# EAGLE schematic FY (EAGLE 9.6.2)

## Sheet 1 of 7
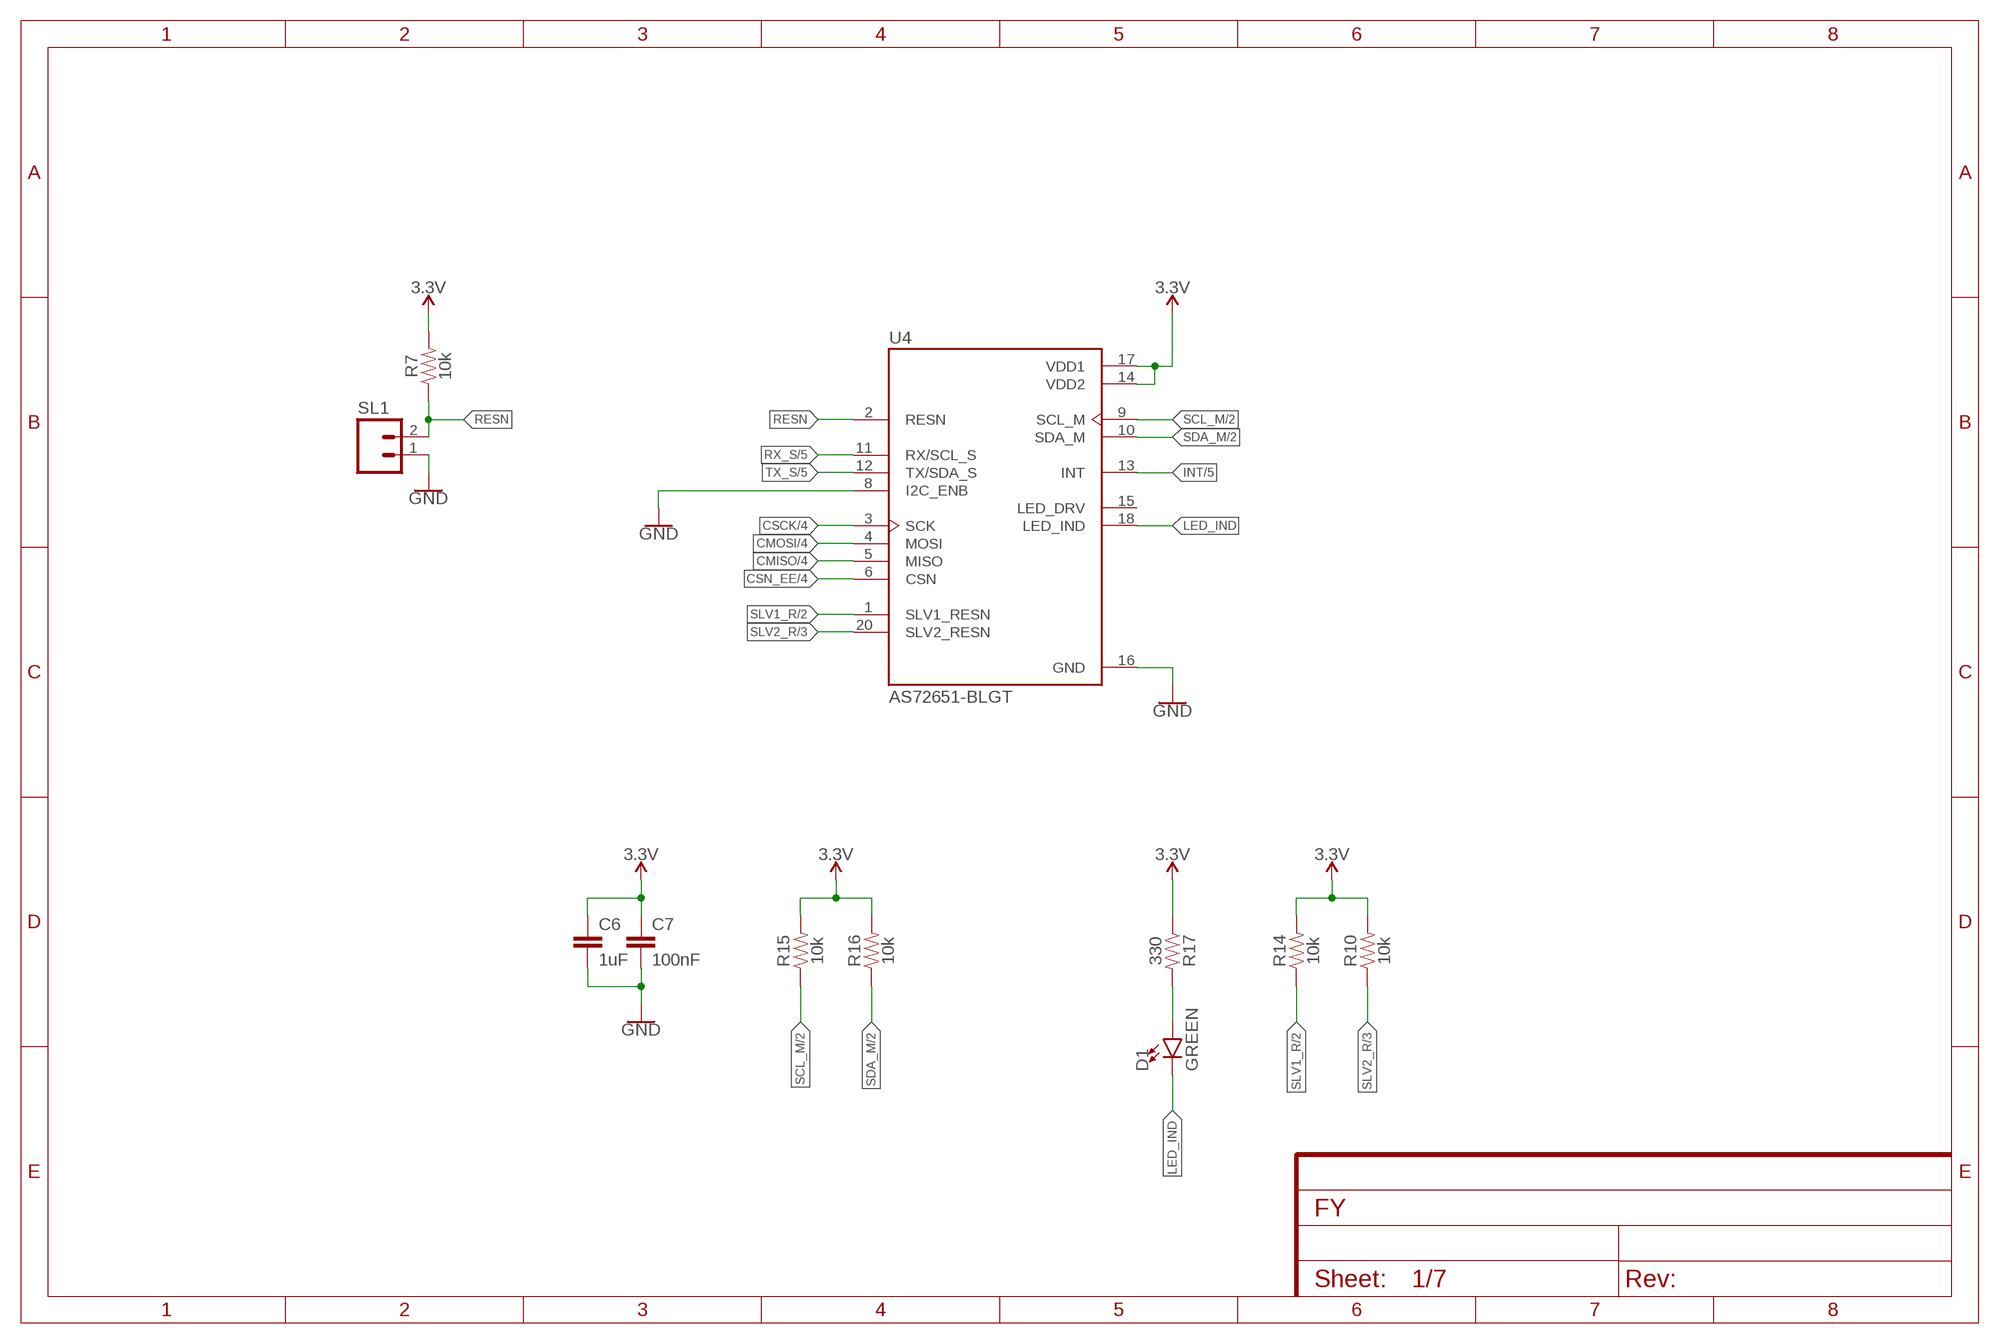
[diagram p0: schematic, sheet 1]

### Parts
C6  1uF  10UF-0603-6.3V-20%  [0603]
C7  100nF  0.1UF-0603-25V-(+80/-20%)  [0603]
D1  GREEN  LED-GREEN0603  [LED-0603]
R7  10k  10KOHM-0603-1/10W-1%  [0603]
R10  10k  10KOHM-0603-1/10W-1%  [0603]
R14  10k  10KOHM-0603-1/10W-1%  [0603]
R15  10k  10KOHM-0603-1/10W-1%  [0603]
R16  10k  10KOHM-0603-1/10W-1%  [0603]
R17  330  10KOHM-0603-1/10W-1%  [0603]
SL1  M02  [02P]
U4  AS72651-BLGT  [PQFN65P470X450X270-20N]

### Nets
3.3V [Power]: C6.1 C7.1 R7.2 R10.2 R14.2 R15.2 R16.2 R17.1 U4.14(VDD2) U4.17(VDD1) ; also sheet 2,3,4,5,6,7
CMISO: U4.5(MISO) ; also sheet 4
CMOSI: U4.4(MOSI) ; also sheet 4
CSCK: U4.3(SCK) ; also sheet 4
CSN_EE: U4.6(CSN) ; also sheet 4
GND: C6.2 C7.2 SL1.1 U4.8(I2C_ENB) U4.16(GND) ; also sheet 2,3,4,5,6,7
INT: U4.13(INT) ; also sheet 5
LED_IND: D1.C U4.18(LED_IND)
N$14: D1.A R17.2
RESN: R7.1 SL1.2 U4.2(RESN)
RX_S: U4.11(RX/SCL_S) ; also sheet 5
SCL_M: R15.1 U4.9(SCL_M) ; also sheet 2,3
SDA_M: R16.1 U4.10(SDA_M) ; also sheet 2,3
SLV1_R: R14.1 U4.1(SLV1_RESN) ; also sheet 2
SLV2_R: R10.1 U4.20(SLV2_RESN) ; also sheet 3
TX_S: U4.12(TX/SDA_S) ; also sheet 5
Unconnected: U4.15(LED_DRV)

## Sheet 2 of 7
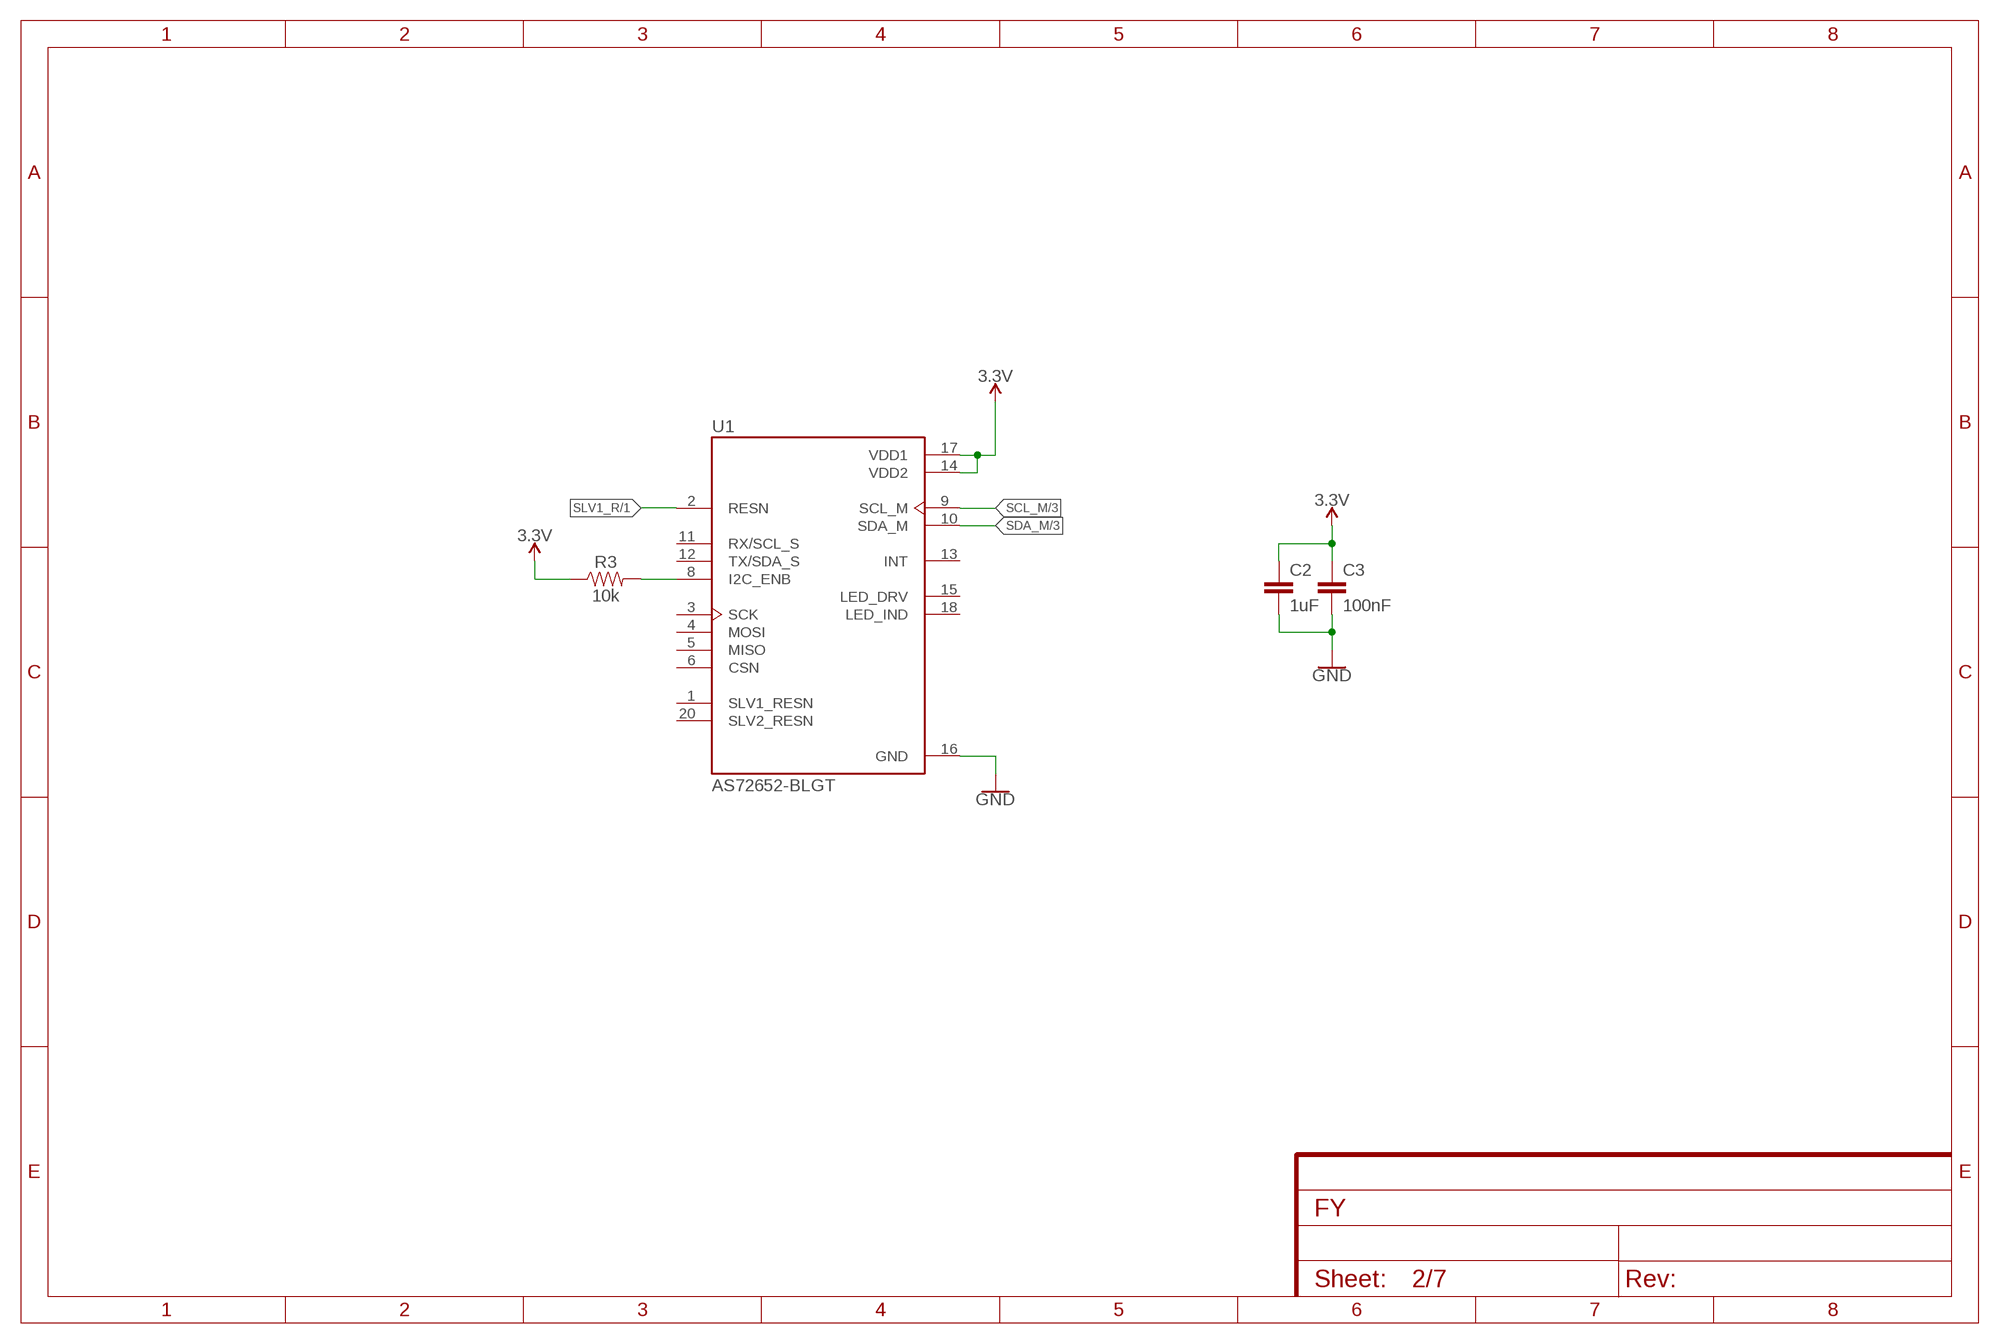
[diagram p1: schematic, sheet 2]

### Parts
C2  1uF  10UF-0603-6.3V-20%  [0603]
C3  100nF  0.1UF-0603-25V-(+80/-20%)  [0603]
R3  10k  0.05OHM-0603-1/5W-1%  [0603]
U1  AS72652-BLGT  AS72651-BLGT  [PQFN65P470X450X270-20N]

### Nets
3.3V [Power]: C2.1 C3.1 R3.1 U1.14(VDD2) U1.17(VDD1) ; also sheet 1,3,4,5,6,7
GND: C2.2 C3.2 U1.16(GND) ; also sheet 1,3,4,5,6,7
N$1: R3.2 U1.8(I2C_ENB)
SCL_M: U1.9(SCL_M) ; also sheet 1,3
SDA_M: U1.10(SDA_M) ; also sheet 1,3
SLV1_R: U1.2(RESN) ; also sheet 1
Unconnected: U1.1(SLV1_RESN) U1.3(SCK) U1.4(MOSI) U1.5(MISO) U1.6(CSN) U1.11(RX/SCL_S) U1.12(TX/SDA_S) U1.13(INT) U1.15(LED_DRV) U1.18(LED_IND) U1.20(SLV2_RESN)

## Sheet 3 of 7
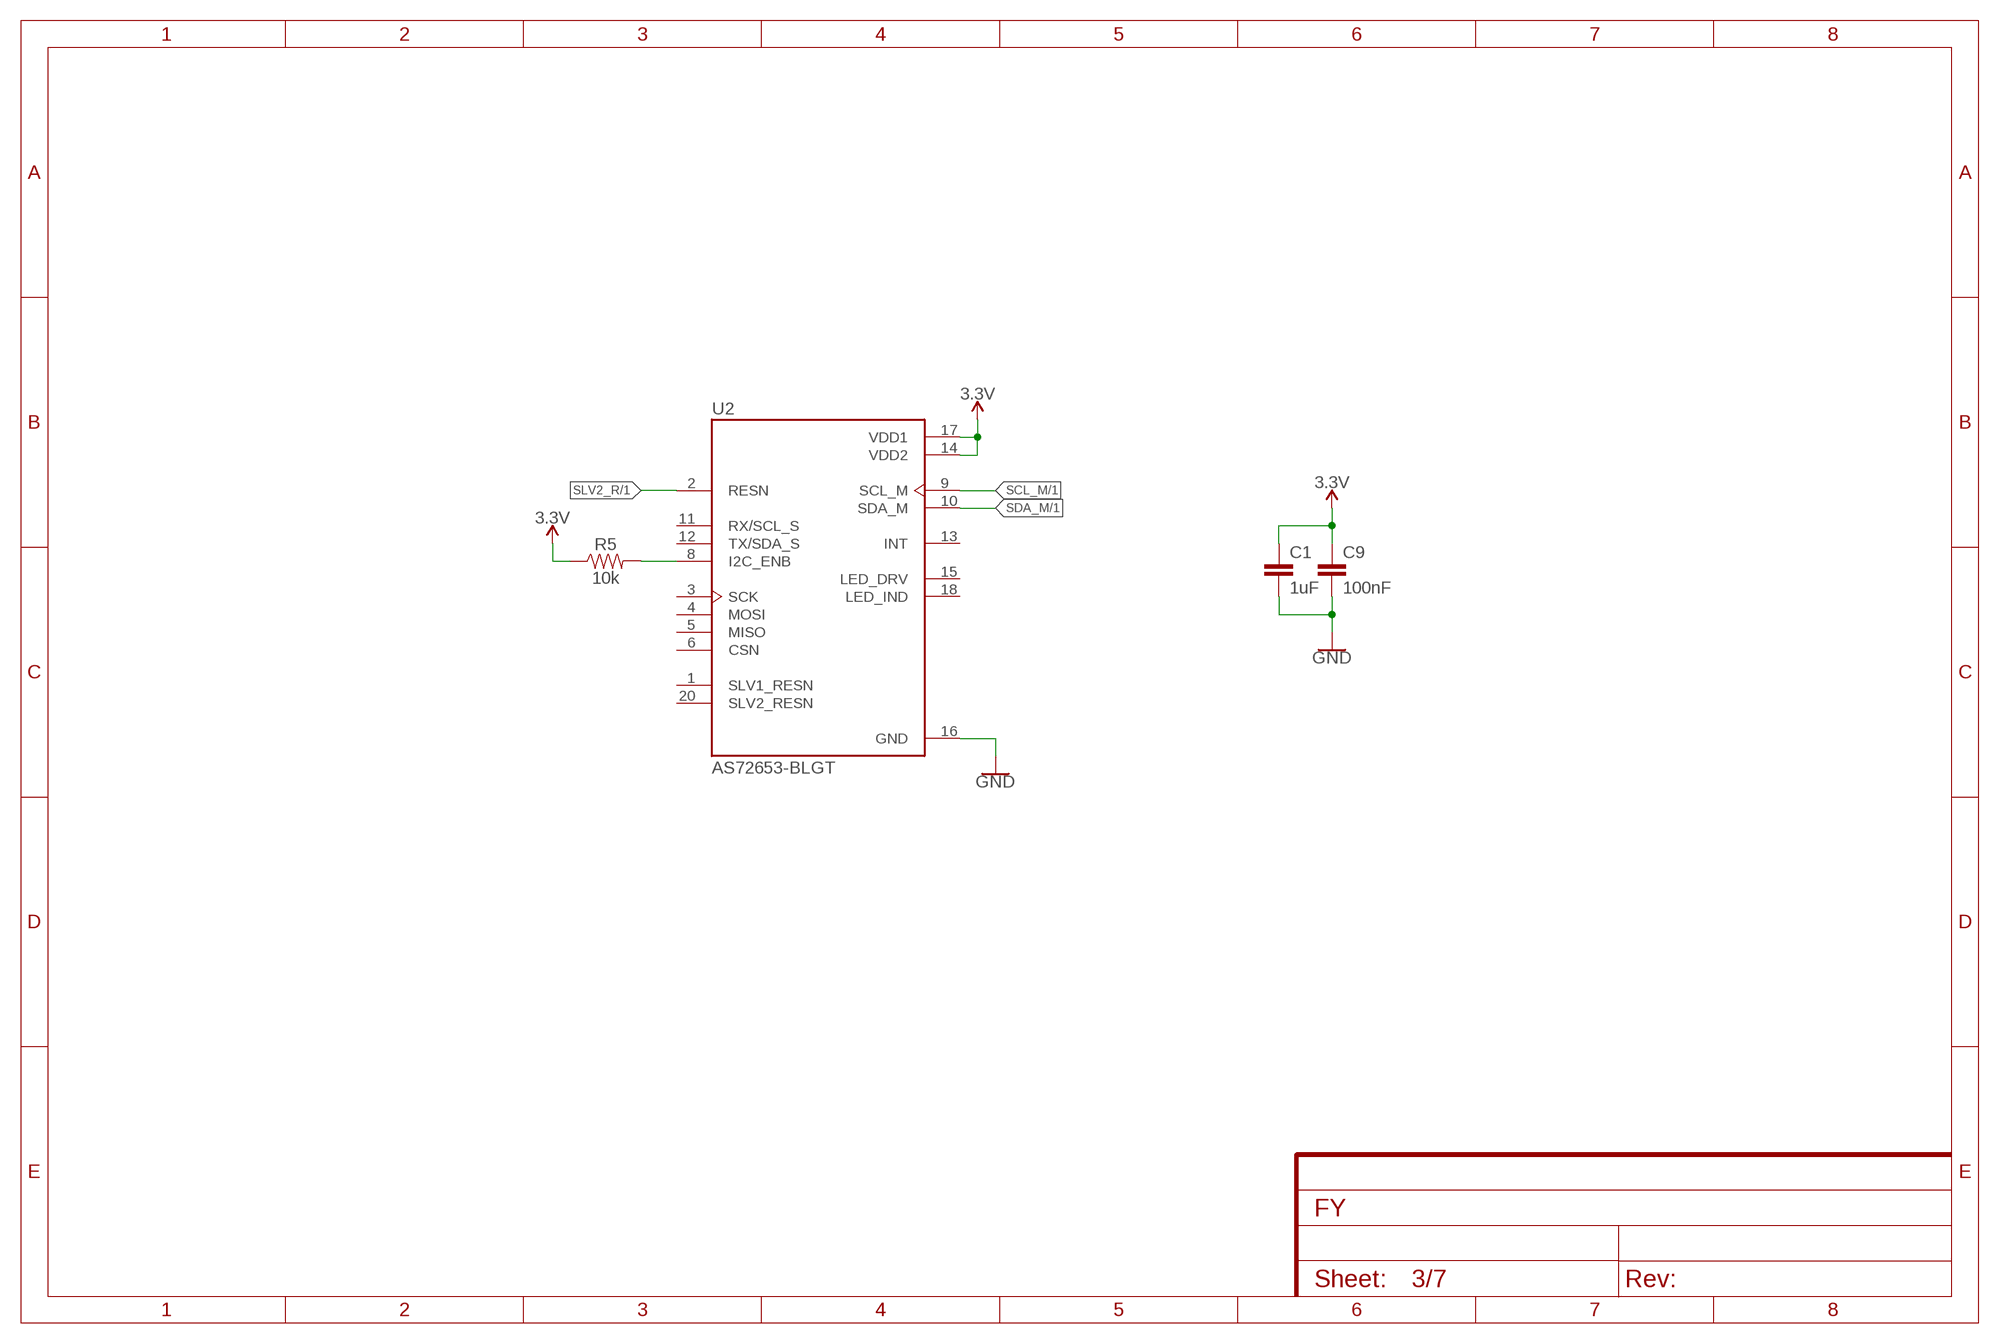
[diagram p2: schematic, sheet 3]

### Parts
C1  1uF  10UF-0603-6.3V-20%  [0603]
C9  100nF  0.1UF-0603-25V-(+80/-20%)  [0603]
R5  10k  0.05OHM-0603-1/5W-1%  [0603]
U2  AS72653-BLGT  AS72651-BLGT  [PQFN65P470X450X270-20N]

### Nets
3.3V [Power]: C1.1 C9.1 R5.1 U2.14(VDD2) U2.17(VDD1) ; also sheet 1,2,4,5,6,7
GND: C1.2 C9.2 U2.16(GND) ; also sheet 1,2,4,5,6,7
N$5: R5.2 U2.8(I2C_ENB)
SCL_M: U2.9(SCL_M) ; also sheet 1,2
SDA_M: U2.10(SDA_M) ; also sheet 1,2
SLV2_R: U2.2(RESN) ; also sheet 1
Unconnected: U2.1(SLV1_RESN) U2.3(SCK) U2.4(MOSI) U2.5(MISO) U2.6(CSN) U2.11(RX/SCL_S) U2.12(TX/SDA_S) U2.13(INT) U2.15(LED_DRV) U2.18(LED_IND) U2.20(SLV2_RESN)

## Sheet 4 of 7
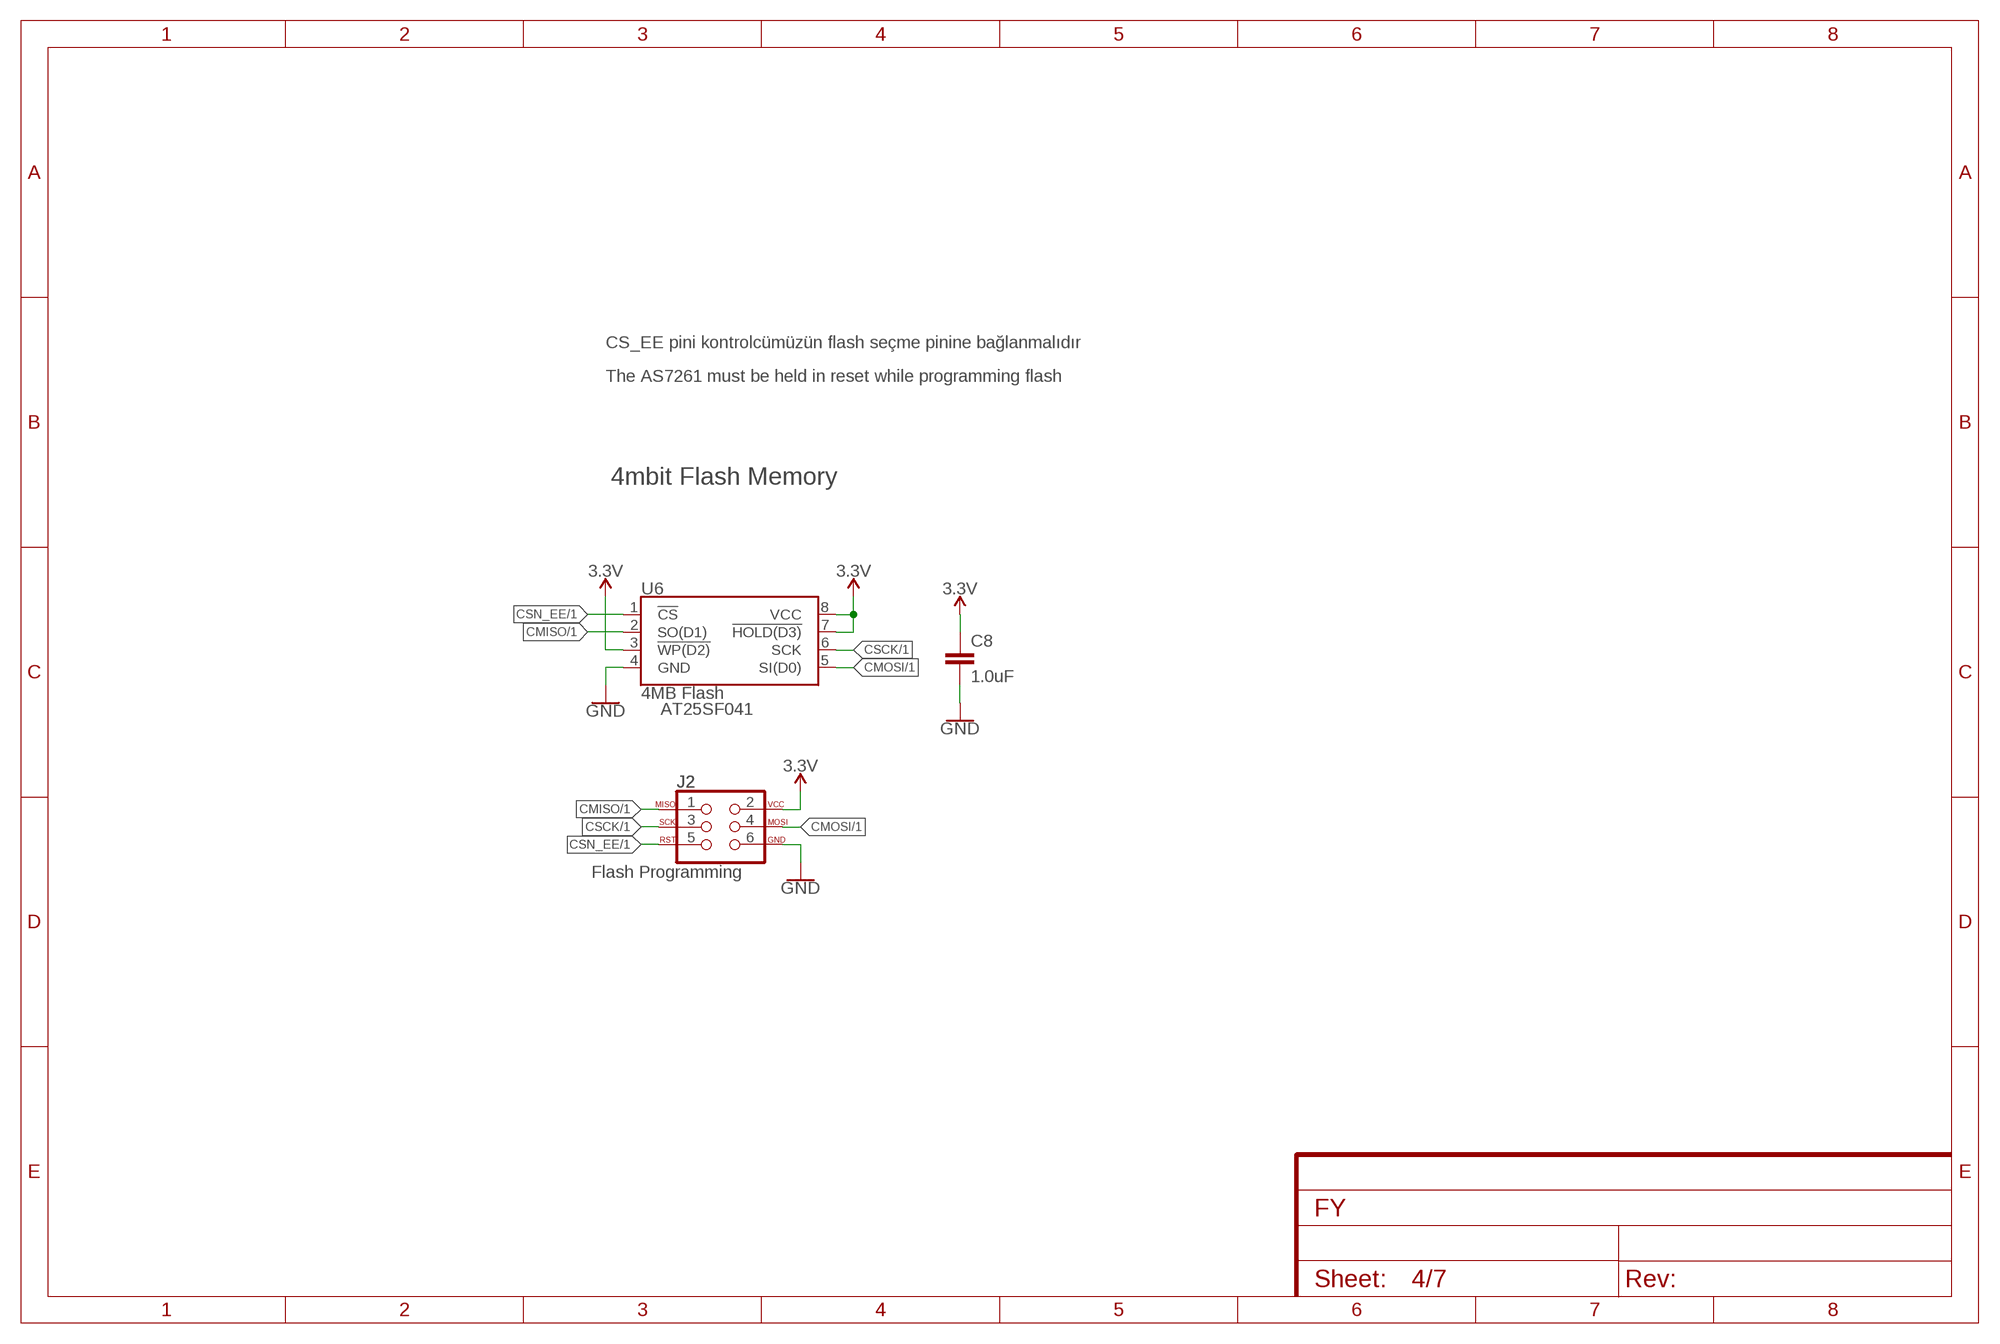
[diagram p3: schematic, sheet 4]

### Parts
C8  1.0uF  1.0UF-0603-16V-10%  [0603]
J2  Flash Programming  AVR_SPI_PROG_3X2TESTPOINTS  [2X3_TEST_POINTS]
U6  4MB Flash  AT25SF041  [SO08]

### Nets
3.3V [Power]: C8.1 J2.2 U6.3(!WP(D2)) U6.7(!HOLD(D3)) U6.8(VCC) ; also sheet 1,2,3,5,6,7
CMISO: J2.1 U6.2(SO(D1)) ; also sheet 1
CMOSI: J2.4 U6.5(SI(D0)) ; also sheet 1
CSCK: J2.3 U6.6(SCK) ; also sheet 1
CSN_EE: J2.5 U6.1(!CS) ; also sheet 1
GND: C8.2 J2.6 U6.4(GND) ; also sheet 1,2,3,5,6,7

### Notes on the sheet
- CS_EE pini kontrolcümüzün flash seçme pinine bağlanmalıdır
- The AS7261 must be held in reset while programming flash
- 4mbit Flash Memory
- AT25SF041

## Sheet 5 of 7
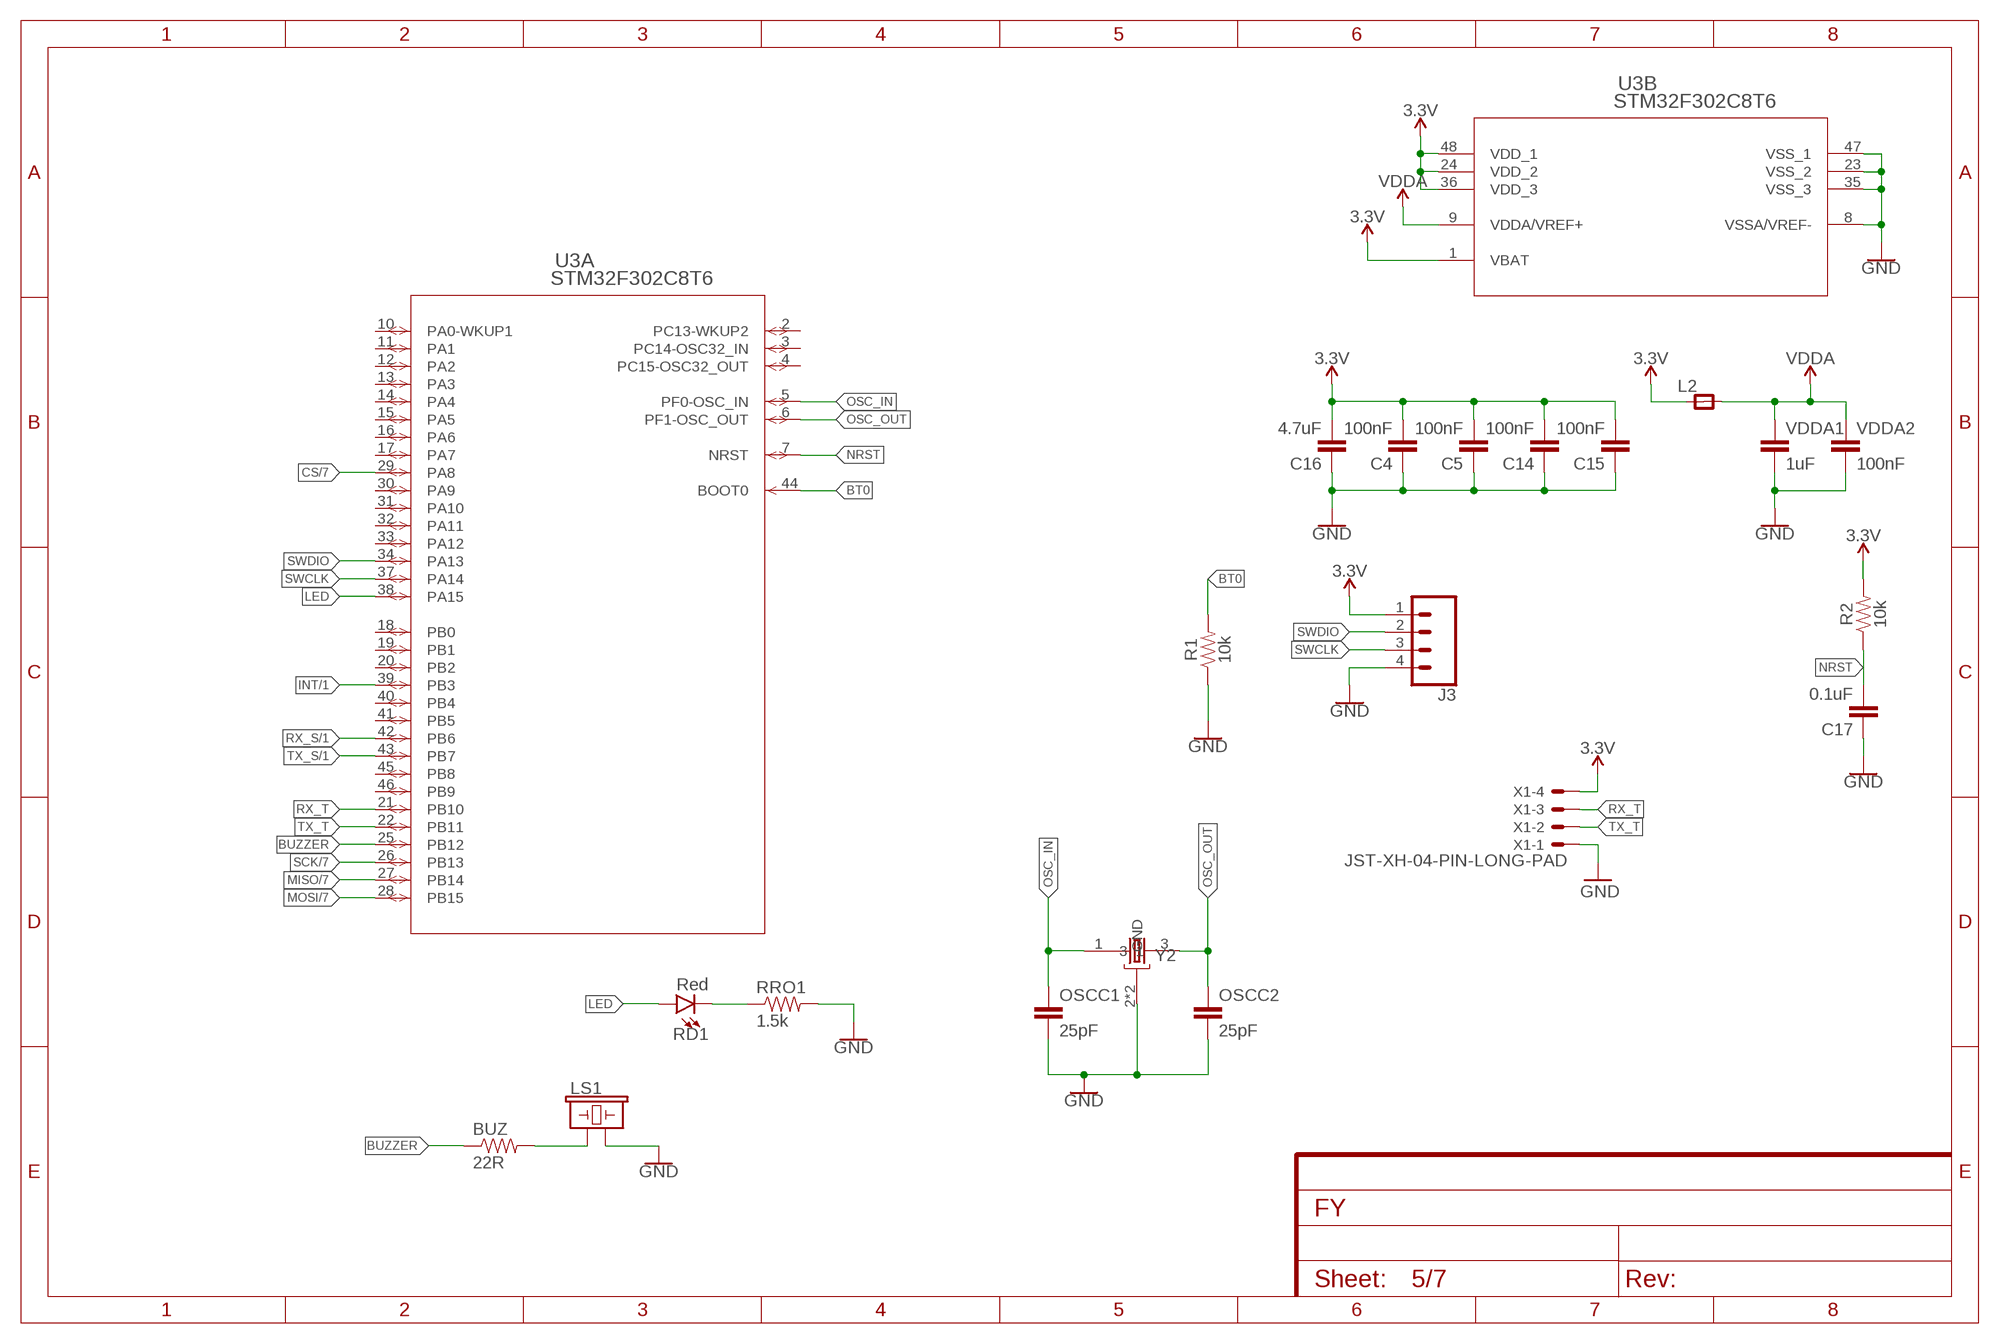
[diagram p4: schematic, sheet 5]

### Parts
BUZ  22R  2.0KOHM1/10W5%(0603)  [0603-RES]
C4  100nF  22PF-0603-50V-5%  [0603]
C5  100nF  22PF-0603-50V-5%  [0603]
C14  100nF  22PF-0603-50V-5%  [0603]
C15  100nF  22PF-0603-50V-5%  [0603]
C16  4.7uF  22PF-0603-50V-5%  [0603]
C17  0.1uF  22PF-0603-50V-5%  [0603]
J3  CONN_04  [1X04]
L2  RC-MASTER-SMD_FB_0805MP  [RC-MASTER-SMD_L0805MP]
LS1  BUZZER-PTH  [BUZZER-12MM]
OSCC1  25pF  0.1UF-0603-25V-(+80/-20%)  [0603]
OSCC2  25pF  0.1UF-0603-25V-(+80/-20%)  [0603]
R1  10k  0.05OHM-0603-1/5W-1%  [0603]
R2  10k  0.05OHM-0603-1/5W-1%  [0603]
RD1  Red  LED-RED0603-SMART  [LED-0603]
RRO1  1.5k  2.0KOHM1/10W5%(0603)  [0603-RES]
U3  STM32F302C8T6  [LQFP48-7X7MM]
VDDA1  1uF  0.1UF-0603-25V-(+80/-20%)  [0603]
VDDA2  100nF  0.1UF-0603-25V-(+80/-20%)  [0603]
X1  JST-XH-04-PIN-LONG-PAD  [JST-XH-04-PACKAGE-LONG-PAD]
Y2  ABM2B-8.000MHZ-10-1-U-T  ABM3B-26.000MHZ-10-1-U-T  [OSCCC500X320X110-4N]

### Nets
3.3V [Power]: C4.2 C5.2 C14.2 C15.2 C16.2 J3.1 L2.1 R2.2 U3.1(B:VBAT) U3.24(B:VDD_2) U3.36(B:VDD_3) U3.48(B:VDD_1) X1.4 ; also sheet 1,2,3,4,6,7
BT0: R1.2 U3.44(A:BOOT0)
BUZZER: BUZ.1 U3.25(A:PB12)
CS: U3.29(A:PA8) ; also sheet 7
GND: C4.1 C5.1 C14.1 C15.1 C16.1 C17.1 J3.4 LS1.- OSCC1.2 OSCC2.2 R1.1 RRO1.2 U3.8(B:VSSA/VREF-) U3.23(B:VSS_2) U3.35(B:VSS_3) U3.47(B:VSS_1) VDDA1.2 VDDA2.2 X1.1 Y2.2(GND) Y2.4(GND) ; also sheet 1,2,3,4,6,7
INT: U3.39(A:PB3) ; also sheet 1
LED: RD1.A U3.38(A:PA15)
MISO: U3.27(A:PB14) ; also sheet 7
MOSI: U3.28(A:PB15) ; also sheet 7
N$2: RD1.C RRO1.1
N$13: BUZ.2 LS1.+
NRST: C17.2 R2.1 U3.7(A:NRST)
OSC_IN: OSCC1.1 U3.5(A:PF0-OSC_IN) Y2.1
OSC_OUT: OSCC2.1 U3.6(A:PF1-OSC_OUT) Y2.3
RX_S: U3.42(A:PB6) ; also sheet 1
RX_T: U3.21(A:PB10) X1.3
SCK: U3.26(A:PB13) ; also sheet 7
SWCLK: J3.3 U3.37(A:PA14)
SWDIO: J3.2 U3.34(A:PA13)
TX_S: U3.43(A:PB7) ; also sheet 1
TX_T: U3.22(A:PB11) X1.2
VDDA: L2.2 U3.9(B:VDDA/VREF+) VDDA1.1 VDDA2.1
Unconnected: U3.2(A:PC13-WKUP2) U3.3(A:PC14-OSC32_IN) U3.4(A:PC15-OSC32_OUT) U3.10(A:PA0-WKUP1) U3.11(A:PA1) U3.12(A:PA2) U3.13(A:PA3) U3.14(A:PA4) U3.15(A:PA5) U3.16(A:PA6) U3.17(A:PA7) U3.18(A:PB0) U3.19(A:PB1) U3.20(A:PB2) U3.30(A:PA9) U3.31(A:PA10) U3.32(A:PA11) U3.33(A:PA12) U3.40(A:PB4) U3.41(A:PB5) U3.45(A:PB8) U3.46(A:PB9)

## Sheet 6 of 7
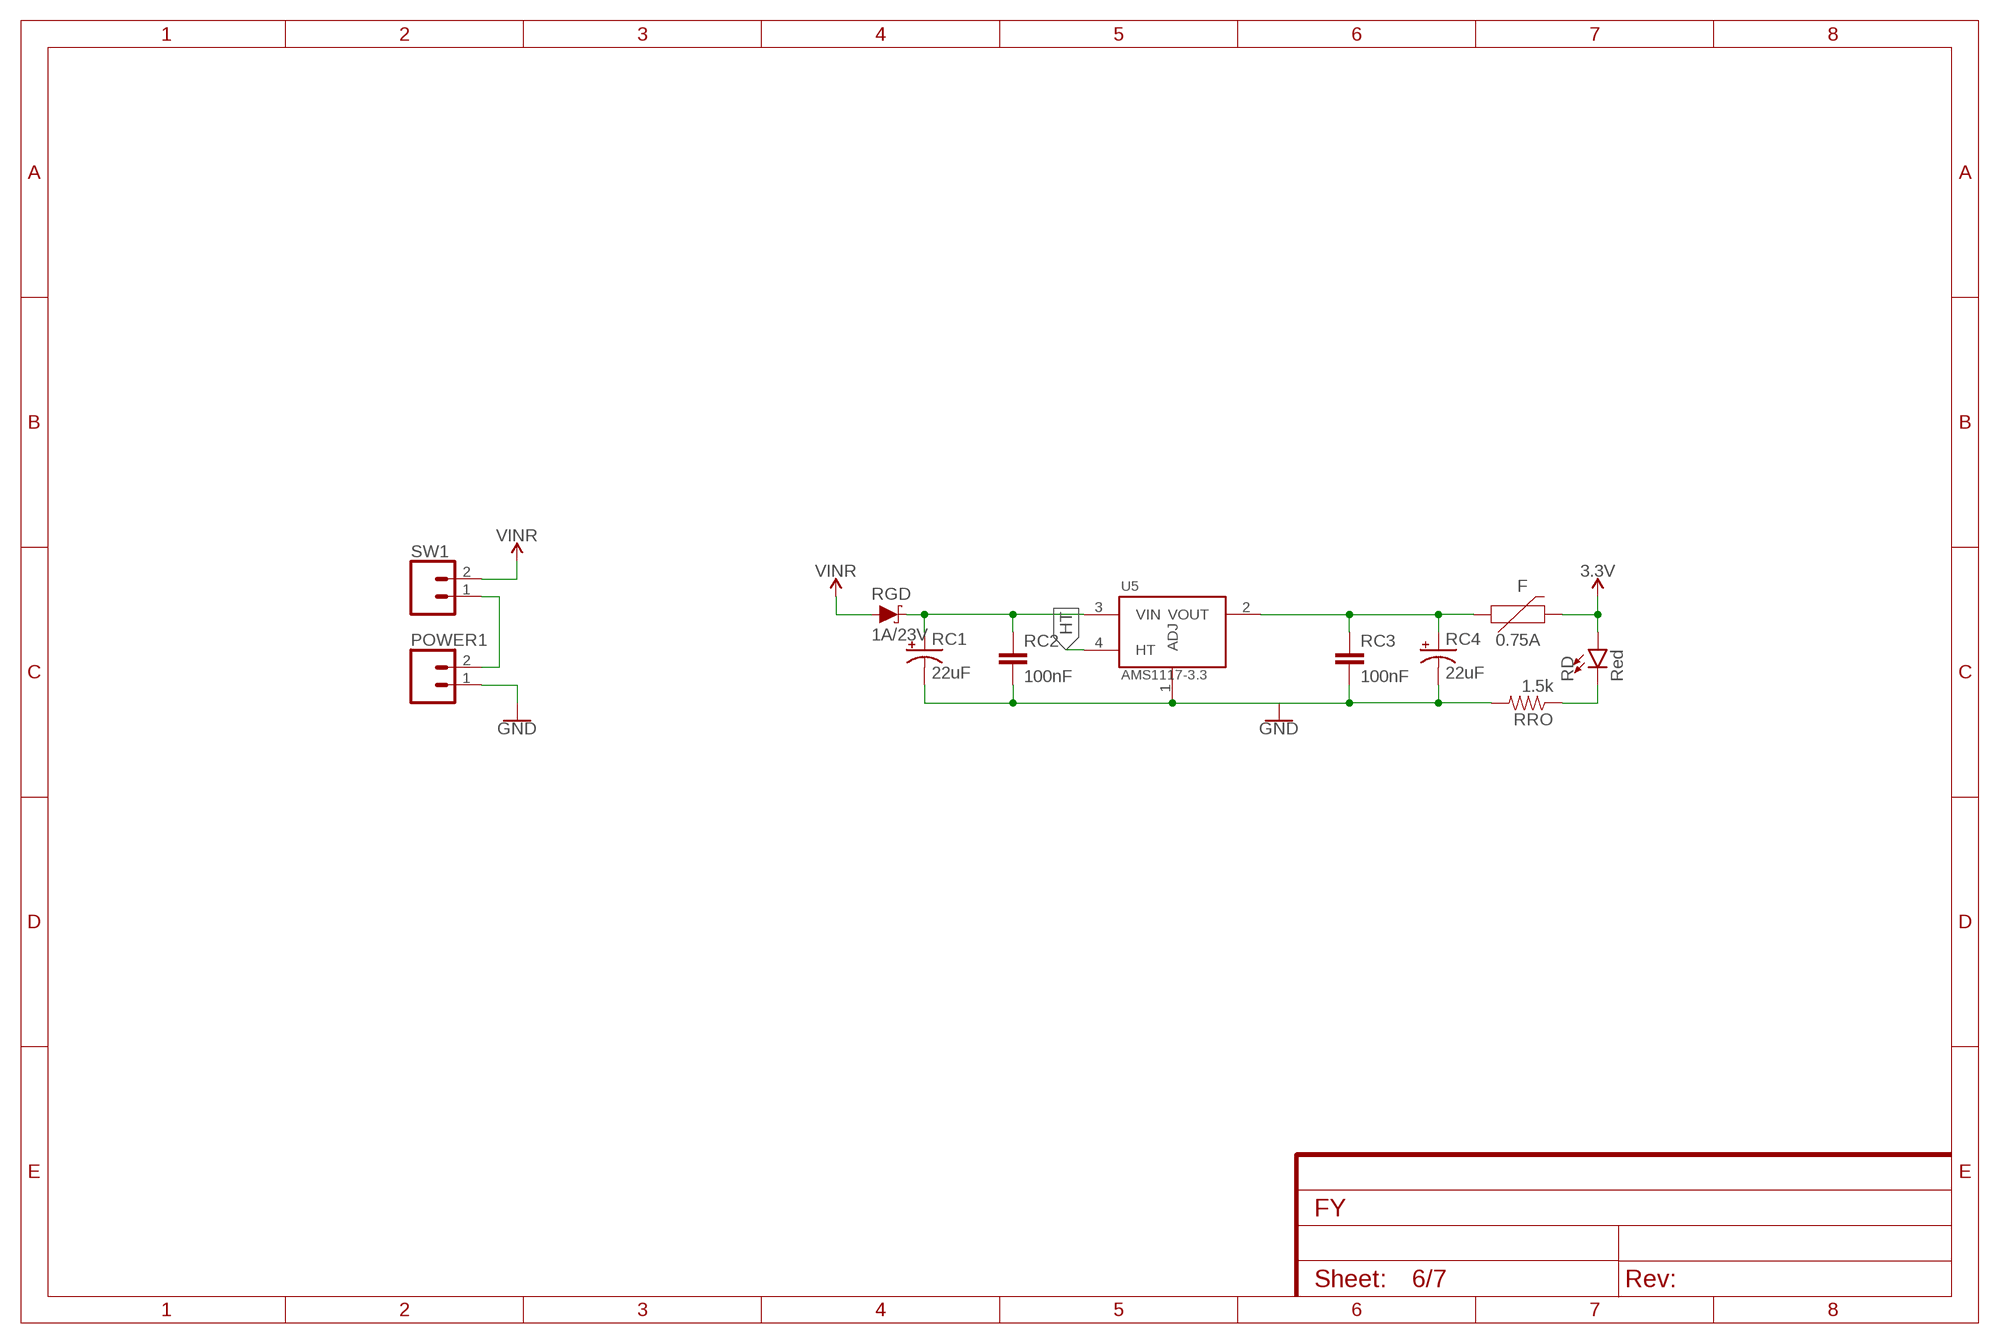
[diagram p5: schematic, sheet 6]

### Parts
F  0.75A  PPTC_THREE-QUARTER-AMP  [1206]
POWER1  CONN_023.5MM-NO_SILK  [SCREWTERMINAL-3.5MM-2-NS]
RC1  22uF  10UF-POLAR-EIA3528-20V-10%(TANT)  [EIA3528]
RC2  100nF  0.1UF-0603-25V-(+80/-20%)  [0603]
RC3  100nF  0.1UF-0603-25V-(+80/-20%)  [0603]
RC4  22uF  10UF-POLAR-EIA3528-20V-10%(TANT)  [EIA3528]
RD  Red  LED-RED0603-SMART  [LED-0603]
RGD  1A/23V  DIODE-SCHOTTKY-BAT20J  [SOD-323]
RRO  1.5k  2.0KOHM1/10W5%(0603)  [0603-RES]
SW1  CONN_023.5MM-NO_SILK  [SCREWTERMINAL-3.5MM-2-NS]
U5  AMS1117-3.3  [SOT229P700X180-4N]

### Nets
3.3V [Power]: F.2 RD.A ; also sheet 1,2,3,4,5,7
GND: POWER1.1 RC1.C(-) RC2.2 RC3.2 RC4.C(-) RRO.2 U5.1(ADJ) ; also sheet 1,2,3,4,5,7
HT: U5.4(HT)
N$3: POWER1.2 SW1.1
N$6: F.1 RC3.1 RC4.A(+) U5.2(VOUT)
N$11: RD.C RRO.1
VIN: RGD.A SW1.2 ; supply symbol labelled VINR
VNR: RC1.A(+) RC2.1 RGD.C U5.3(VIN)

## Sheet 7 of 7
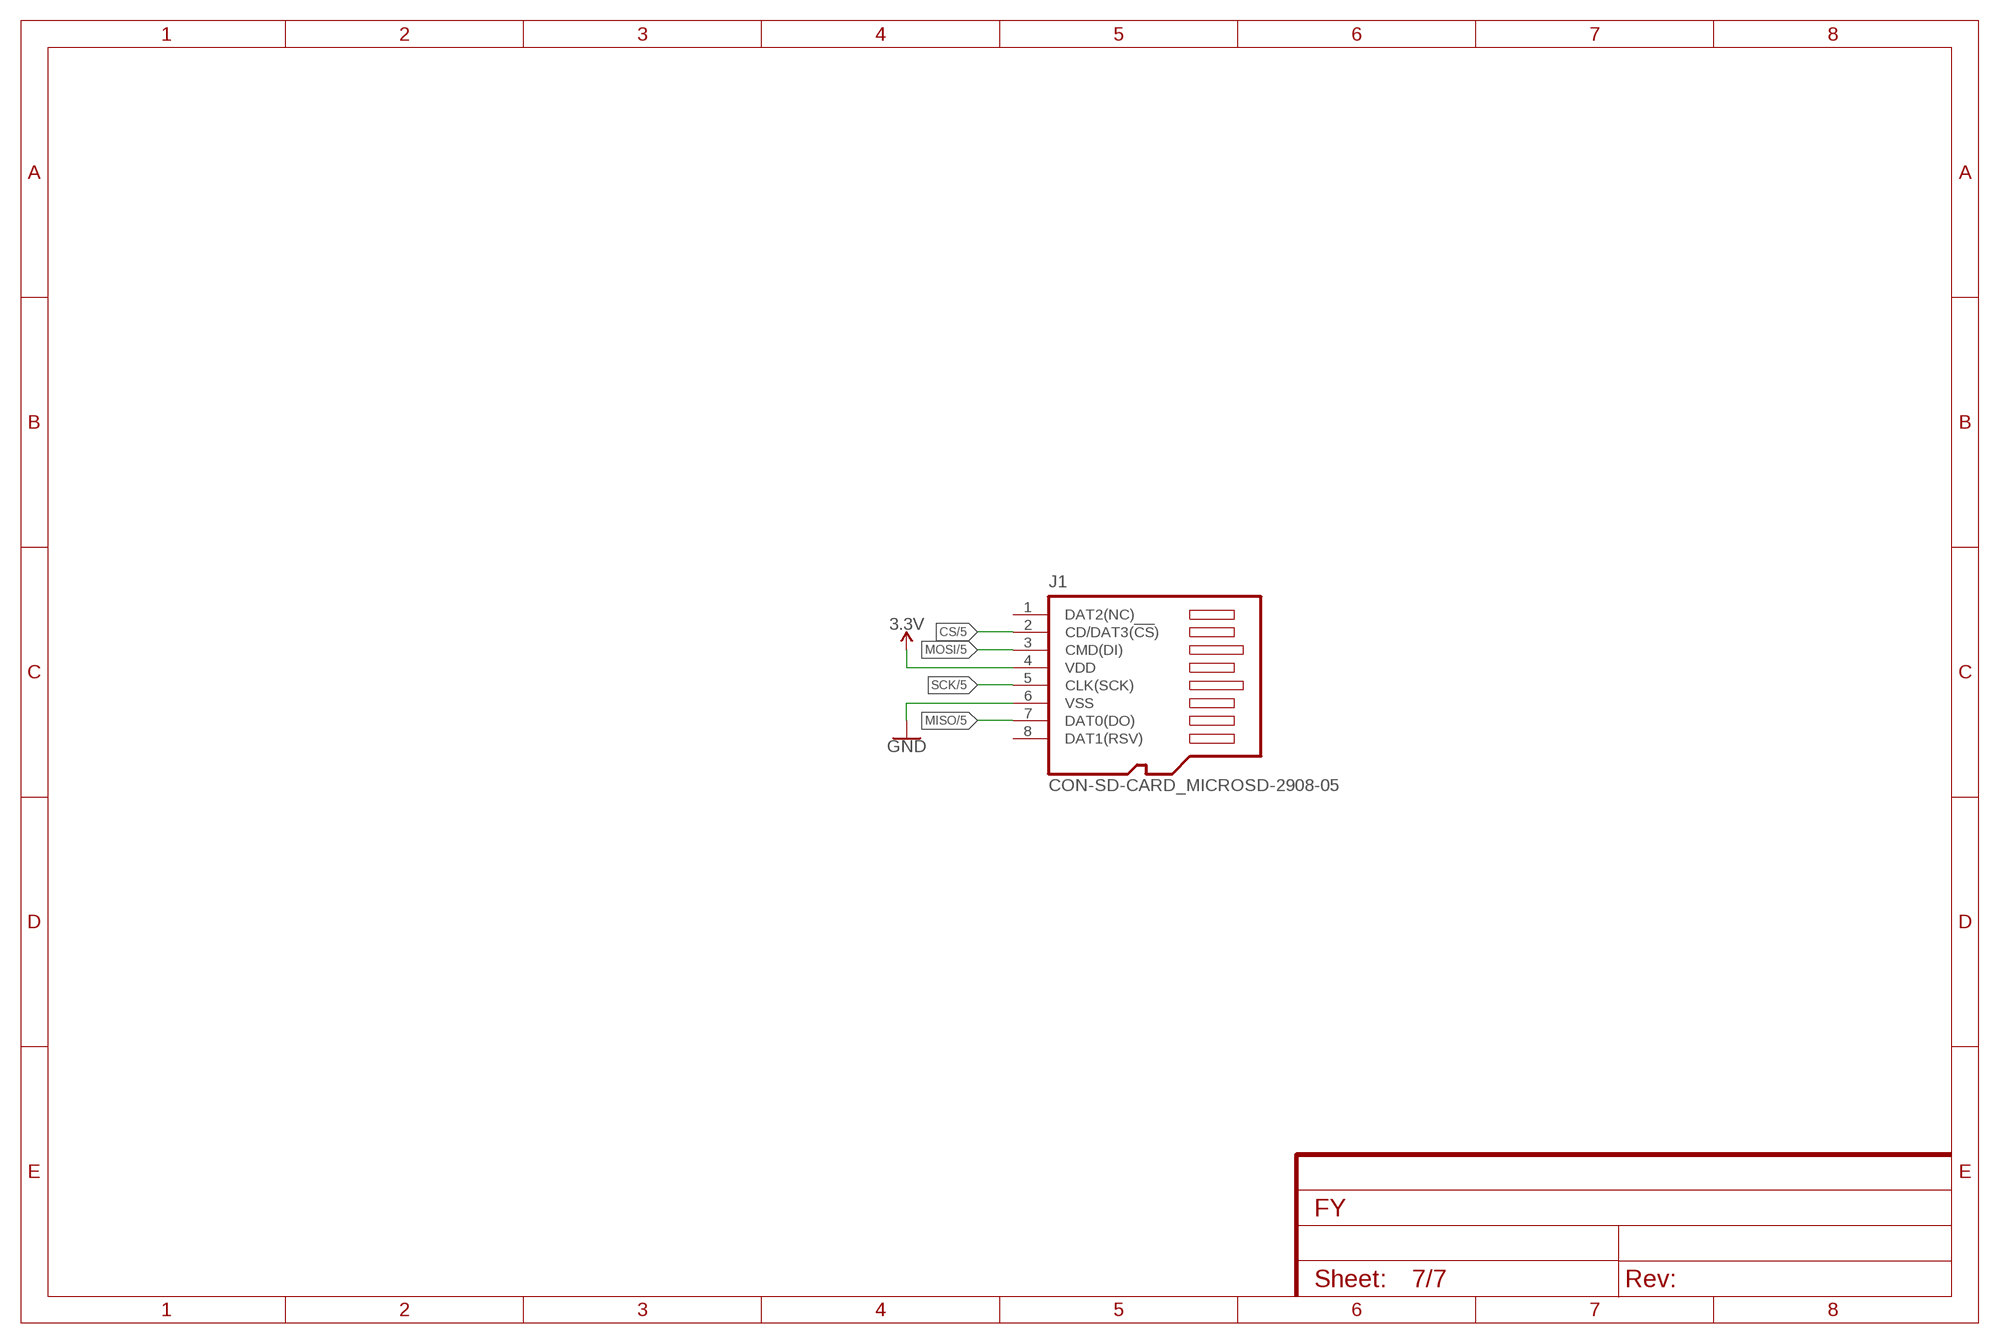
[diagram p6: schematic, sheet 7]

### Parts
J1  CON-SD-CARD_MICROSD-2908-05  [CON-SD-CARD_2908-05]

### Nets
3.3V [Power]: J1.4(VDD) ; also sheet 1,2,3,4,5,6
CS: J1.2(CD/DAT3(!CS!)) ; also sheet 5
GND: J1.6(VSS) ; also sheet 1,2,3,4,5,6
MISO: J1.7(DAT0(DO)) ; also sheet 5
MOSI: J1.3(CMD(DI)) ; also sheet 5
SCK: J1.5(CLK(SCK)) ; also sheet 5
Unconnected: J1.1(DAT2(NC)) J1.8(DAT1(RSV)) J1.GND@1(GND) J1.GND@2(GND) J1.GND@3(GND) J1.GND@4(GND)

## Library data of the parts
BUZ RRO RRO1 = SparkFun-Resistors:2.0KOHM1/10W5%(0603): RES-08296; PROD_ID: RES-08296; VALUE: 2.0k
C1 C2 C6 = SparkFun-Capacitors:10UF: 10.0µF ceramic capacitors A capacitor is a passive two-terminal electrical component used to store electrical energy temporarily in an electric field.; PROD_ID: CAP-11015; VALUE: 10uF
C3 C7 C9 OSCC1 OSCC2 RC2 RC3 VDDA1 VDDA2 = SparkFun-Capacitors:0.1UF: 0.1µF ceramic capacitors A capacitor is a passive two-terminal electrical component used to store electrical energy temporarily in an electric field.; PROD_ID: CAP-00810; VALUE: 0.1uF
C4 C5 C14-C17 = SparkFun-Capacitors:22PF: 22pF ceramic capacitors A capacitor is a passive two-terminal electrical component used to store electrical energy temporarily in an electric field.; PROD_ID: CAP-07876; VALUE: 22pF
C8 = SparkFun-Capacitors:1.0UF: 1µF ceramic capacitors A capacitor is a passive two-terminal electrical component used to store electrical energy temporarily in an electric field.; PROD_ID: CAP-00868
D1 = SparkFun-LED:LED-GREEN: Green SMD LED Used in manufacturing of various products at SparkFun Packages: 0603 - SMD 0603 package [Product Link] <http://www.futureelectronics.com/en/technologies/semiconductors/optoelectronics/leds/Pages/9894312-LTST-C190GKT.aspx?CrossPart=HSMG-C190&IM=0> LilyPad 1206 - SMD1206 LilyPad package [Product Link] <http://www.futureelectronics.com/en/Technologies/Product.aspx?ProductID=IN150NGHARVATEKCORPORATION2049943&IM=0> 1206 - SMD1206 package [Product Link] <http://www.futureelectronics.com/en/technologies/semiconductors/optoelectronics/leds/Pages/8315665-LTST-C150KGKT.aspx?IM=0> 1206 Bottom Mount -SMD 1206 Bottom Mount [Product Link] <http://www.digikey.com/product-detail/en/lite-on-inc/LTST-C230KGKT/160-1456-1-ND/386854> SparkFun Products: Pro Mini 328 -5V <https://www.sparkfun.com/products/821> RedBoard <https://www.sparkfun.com/products/12757> MP3 Trigger <https://www.sparkfun.com/products/13720> Makey Makey <https://www.sparkfun.com/products/11076>; PROD_ID: DIO-00821
F = SparkFun-Fuses:PPTC: Resettable Fuse PPTC Resettable Fuse. Really a sort of resistor with a polymeric positive temperature coefficient whose resistance increases dramatically with an increase in temperature. When heated by the power passing through the resistance rises causing the current to be limited, protecting the circuit. This is achieved by the transition of the polymer from a crystalline to an amorphous state where the conductive carbon separates breaking the conductive pathways found in the cool crystalline structure. When a PPTC cools back down it resumes conducting letting the circuit turn back on. SparkFun Products: SparkFun RedBoard - Programmed with Arduino <https://www.sparkfun.com/products/12757> Pro Micro - 5V/16MHz <https://www.sparkfun.com/products/12640> Arduino Pro 328 - 5V/16MHz <https://www.sparkfun.com/products/10915> MP3 Trigger <https://www.sparkfun.com/products/13720>; PROD_ID: RES-11150; VALUE: 6V/0.75A
J1 = 52101-101-REV-A_v16:CON-SD-CARD_MICROSD-: microSD Connector
J2 = SparkFun-Connectors:AVR_SPI_PROG_3X2: AVR ISP 6 Pin This is the reduced ISP connector for AVR programming. Common on Arduino. This footprint will take up less PCB space and can be used with a 10-pin to 6-pin adapter such as SKU: BOB-08508 **Special note about "TEST_POINT" package. The stop mask is on the top side, so if you want your programming test points to be on the bottom of your board, make sure to place this package on the bottom side of the board. This also ensure that the orientation to program from the bottom side will be correct. SparkFun Products: SparkFun ISP Pogo Adapter <https://www.sparkfun.com/products/11591> - NS Tiny AVR Programmer <https://www.sparkfun.com/products/11801> -PTH
J3 = SparkFun-Connectors:CONN_04: Multi connection point. Often used as Generic Header-pin footprint for 0.1 inch spaced/style header connections On any of the 0.1 inch spaced packages, you can populate with these: Break Away Headers - Straight <https://www.sparkfun.com/products/116> (PRT-00116) Break Away Male Headers - Right Angle <https://www.sparkfun.com/products/553> (PRT-00553) Female Headers <https://www.sparkfun.com/products/115> (PRT-00115) Break Away Headers - Machine Pin <https://www.sparkfun.com/products/117> (PRT-00117) Break Away Female Headers - Swiss Machine Pin <https://www.sparkfun.com/products/743> (PRT-00743) For SCREWTERMINALS and SPRING TERMINALS visit here: Screw Terimnals on SparkFun.com <https://www.sparkfun.com/search/results?term=Screw+Terminals> (5mm/3.5mm/2.54mm spacing) This device is also useful as a general connection point to wire up your design to another part of your project. Our various solder wires solder well into these plated through hole pads. Hook-Up Wire - Assortment (Stranded, 22 AWG) <https://www.sparkfun.com/products/11375> (PRT-11375) Hook-Up Wire - Assortment (Solid Core, 22 AWG) <https://www.sparkfun.com/products/11367> (PRT-11367) View the entire wire category on our website here <https://www.sparkfun.com/categories/141> Special notes: Molex polarized connector foot print use with SKU : PRT-08231 with associated crimp pins and housings. 1MM SMD Version SKU: PRT-10208; PROD_ID: CONN-09696
L2 = 52101-101-REV-A_v16:RC-MASTER-SMD_FB_: FERRITE BEAD; ORDER_URL: https://eu.mouser.com/ProductDetail/Murata-Electronics/NFZ15SR152SN10D?qs=rkhjVJ6%2F3EK7NITaH%252B9%252Bxg%3D%3D
LS1 = SparkFun-Electromechanical:BUZZER: Buzzer Small round buzzers that operate around the audible 2kHz range. You can use these as speakers to create simple music or user interfaces. Variant Overview: PTH - Mini Speaker - PC Mount 12mm 2.048kHz <https://www.sparkfun.com/products/7950> PTH_KIT - Mini Speaker - PC Mount 12mm 2.048kHz <https://www.sparkfun.com/products/7950> KIT simplifies soldering by adding stop mask to one side of the pads. PTH_NO_SILK - Mini Speaker - PC Mount 12mm 2.048kHz <https://www.sparkfun.com/products/7950> No silkscreen indicator of buzzer outline. PTH_KIT_NO_SILK - Mini Speaker - PC Mount 12mm 2.048kHz <https://www.sparkfun.com/products/7950> KIT package w/o silkscreen SMD - Buzzer Audio Magnetic (CCV-084B16) SMD buzzer used on, e.g. the LilyPad Buzzer <https://www.sparkfun.com/products/8463> and RFID USB Reader <https://www.sparkfun.com/products/9963>. SMD_KIT - Buzzer Audio Magnetic (CCV-084B16) SMD Buzzer with elongated pins to make soldering easier. Used on the SparkFun Simon Says - Surface Mount Soldering Kit <https://www.sparkfun.com/products/10935>.; PROD_ID: COMP-08253; SF_SKU: COM-07950
POWER1 SW1 = SparkFun-Connectors:CONN_02: Multi connection point. Often used as Generic Header-pin footprint for 0.1 inch spaced/style header connections On any of the 0.1 inch spaced packages, you can populate with these: Break Away Headers - Straight <https://www.sparkfun.com/products/116> (PRT-00116) Break Away Male Headers - Right Angle <https://www.sparkfun.com/products/553> (PRT-00553) Female Headers <https://www.sparkfun.com/products/115> (PRT-00115) Break Away Headers - Machine Pin <https://www.sparkfun.com/products/117> (PRT-00117) Break Away Female Headers - Swiss Machine Pin <https://www.sparkfun.com/products/743> (PRT-00743) For SCREWTERMINALS and SPRING TERMINALS visit here: Screw Terimnals on SparkFun.com <https://www.sparkfun.com/search/results?term=Screw+Terminals> (5mm/3.5mm/2.54mm spacing) This device is also useful as a general connection point to wire up your design to another part of your project. Our various solder wires solder well into these plated through hole pads. Hook-Up Wire - Assortment (Stranded, 22 AWG) <https://www.sparkfun.com/products/11375> (PRT-11375) Hook-Up Wire - Assortment (Solid Core, 22 AWG) <https://www.sparkfun.com/products/11367> (PRT-11367) View the entire wire category on our website here <https://www.sparkfun.com/categories/141> Special notes: Molex polarized connector foot print use with: PRT-08233 with associated crimp pins and housings. 2.54_SCREWTERM for use with PRT-10571. 3.5mm Screw Terminal footprints for PRT-08084 5mm Screw Terminal footprints for use with PRT-08432; PROD_ID: CONN-08399
R1-R3 R5 = SparkFun-Resistors:0.05OHM: 0.05Ω resistor A resistor is a passive two-terminal electrical component that implements electrical resistance as a circuit element. Resistors act to reduce current flow, and, at the same time, act to lower voltage levels within circuits. - Wikipedia; PROD_ID: RES-12535; VALUE: 0.05
R7 R10 R14-R16 = SparkFun-Resistors:10KOHM: 10kΩ resistor A resistor is a passive two-terminal electrical component that implements electrical resistance as a circuit element. Resistors act to reduce current flow, and, at the same time, act to lower voltage levels within circuits. - Wikipedia; PROD_ID: RES-00824
R17 = SparkFun-Resistors:10KOHM: 10kΩ resistor A resistor is a passive two-terminal electrical component that implements electrical resistance as a circuit element. Resistors act to reduce current flow, and, at the same time, act to lower voltage levels within circuits. - Wikipedia; PROD_ID: RES-00824; VALUE: 10k
RC1 RC4 = SparkFun-Capacitors:10UF-POLAR: 10.0µF polarized capacitors A capacitor is a passive two-terminal electrical component used to store electrical energy temporarily in an electric field.; PROD_ID: CAP-08063; VALUE: 10uF
RD RD1 = SparkFun-LED:LED-RED: Red SMD LED Used in manufacturing of most products at SparkFun Packages: 0603 - SMD 0603 package [Product Link] <http://docs.avagotech.com/docs/AV02-0551EN> 0603 SMART - SMD 0603 SMART package ( more efficient and expensive)[Product Link] <http://www.osram-os.com/Graphics/XPic2/00077099_0.pdf> 1206 - SMD1206 package [Product Link] <https://www.sparkfun.com/datasheets/DevTools/LilyPad/Q150OVS4.pdff> SparkFun Products: Pro Mini 328 -5V <https://www.sparkfun.com/products/821> RedBoard <https://www.sparkfun.com/products/12757> IOIO-OTG <https://www.sparkfun.com/products/13613>; PROD_ID: DIO-11154
RGD = SparkFun-DiscreteSemi:DIODE-SCHOTTKY: Schottky diode A Schottky diode is a semiconductor diode which has a low forward voltage drop and a very fast switching action.; PROD_ID: DIO-11623; VALUE: 1A/23V/620mV
SL1 = con-amp-quick:M02: AMP QUICK CONNECTOR; OC_FARNELL: unknown; OC_NEWARK: unknown
U1 U2 U4 = AS7265X-BLGT:AS72651-BLGT: Digital 6-channel multi-spectral sensor (near IR light wavelengths) Check prices <https://pricing.snapeda.com/parts/AS72651-BLGT/ams/view-part?ref=eda>; AVAILABILITY: Warning; DESCRIPTION: AS72651-BLGT LGA20 LF T&RDP; MF: ams; MP: AS72651-BLGT; PACKAGE: LGA-20 ams; PRICE: None
U3 = STM32F302C8T6:STM32F302C8T6; BUILT_BY: EMA_UL_Team; COPYRIGHT: Copyright (C) 2018 Accelerated Designs. All rights reserved; MANUFACTURER_PART_NUMBER: STM32F302C8T6; SOURCELIBRARY: Updates_to_database_2020-10-19; VENDOR: STMicroelectronics
U5 = AMS1117-3.3:AMS1117-3.3: Sot223/Pkg 1-Amp 3.3-Volt Low Drop Out Voltage Regulatator; AVAILABILITY: Unavailable; DESCRIPTION: Sot223/Pkg 1-Amp 3.3-Volt Low Drop Out Voltage Regulatator; MF: Advanced Monolithic Systems; MP: AMS1117-3.3; PACKAGE: SOT-89 ams; PRICE: None
U6 = SparkFun-IC-Memory:AT25SF041: AT25SF041 4Mb Serial Flash Memory 104MHz, SPI, 8-SOIC Datasheet <http://www.adestotech.com/wp-content/uploads/DS-AT25SF041_044.pdf> SparkFun Products: SparkFun ESP8266 Thing <https://www.sparkfun.com/products/13231> SparkFun ESP8266 Thing - Dev Board <https://www.sparkfun.com/products/13711>; ORDER_URL: https://eu.mouser.com/ProductDetail/Adesto-Technologies/AT25SF041B-SHB-T?qs=wnTfsH77Xs7aj0PSgtTkzg%3D%3D; PROD_ID: IC-12455
X1 = Rembrandt Electronics - JST XH Connectors v1-0:JST-XH-04-PIN: JST XH Connector 2 Pin Wire to board connector. Pitch: 2,54 mm, (0.100") Number of pins: 4 Created by Rembrandt Electronics www.rembrandtelectronics.com
Y2 = ABM3B-26.000MHZ-10-1-U-T:ABM3B-26.000MHZ-10-1-U-T: Ceramic SMD Crystal Check prices <https://pricing.snapeda.com/parts/ABM3B-26.000MHZ-10-1-U-T/Abracon/view-part?ref=eda>; AVAILABILITY: Good; DESCRIPTION: 26MHz ±10ppm Crystal 10pF 50 Ohms 4-SMD, No Lead; MF: Abracon; MP: ABM3B-26.000MHZ-10-1-U-T; PACKAGE: SMD-4 Abracon LLC; PRICE: None; PURCHASE-URL: https://pricing.snapeda.com/search/part/ABM3B-26.000MHZ-10-1-U-T/?ref=eda

## Net classes
1 Power: width 0.305 mm